# Altium project PCB_Project.PrjPcb
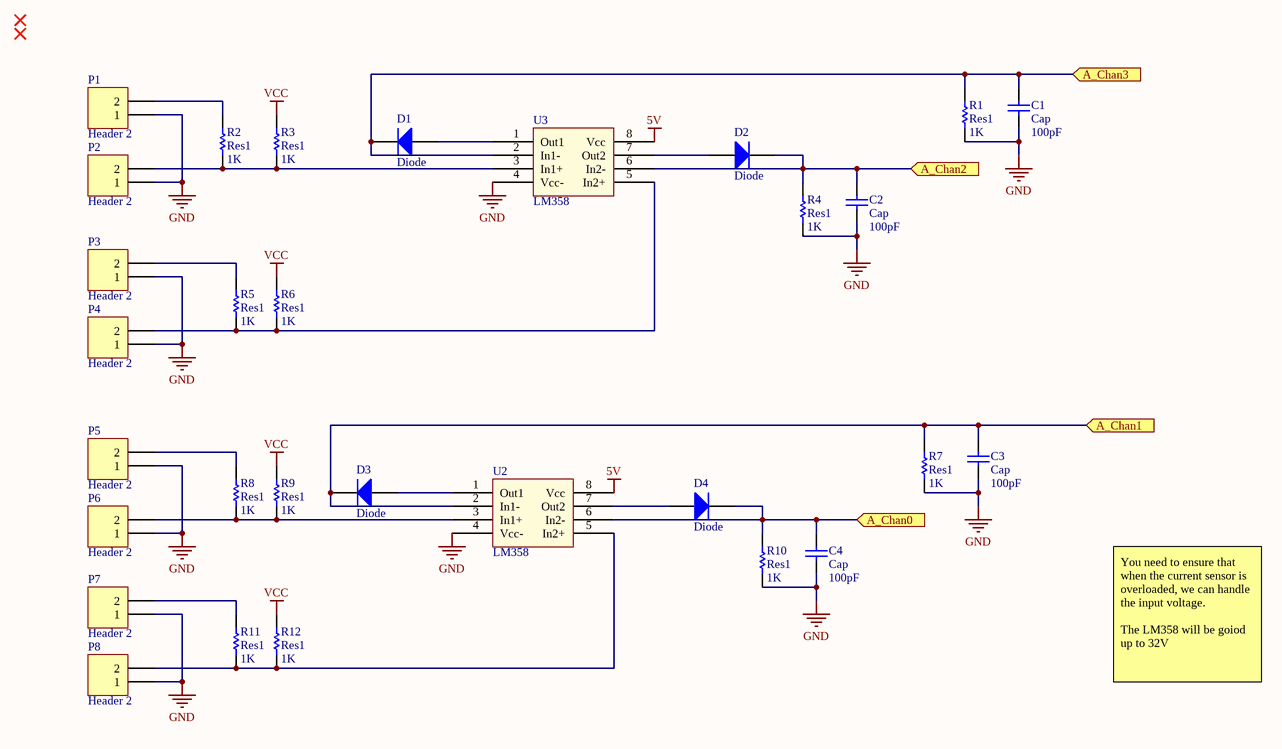
[diagram p0: AnalogIn.SchDoc]
3 sheets, 110 parts. Net scope: flat (ports and power ports of the same name join across sheets).
Board file: PCB1.PcbDoc
Sheets:
  AnalogIn.SchDoc
  Micro.SchDoc
  RTC-Power-Eth.SchDoc

## Sheet AnalogIn.SchDoc
size A4; SheetNumber: 1; SheetTotal: 3

### Parts
C1  Cap  value 100pF  [CAPC2012X04M]
C2  Cap  value 100pF  [CAPC2012X04M]
C3  Cap  value 100pF  [CAPC2012X04M]
C4  Cap  value 100pF  [CAPC2012X04M]
D1  Diode  [DIOC2012X04M]
D2  Diode  [DIOC2012X04M]
D3  Diode  [DIOC2012X04M]
D4  Diode  [DIOC2012X04M]
P1  Header 2  [HDR1X2]
P2  Header 2  [WURTH- WR-TBL 2pin 5mmpitch]
P3  Header 2  [HDR1X2]
P4  Header 2  [WURTH- WR-TBL 2pin 5mmpitch]
P5  Header 2  [HDR1X2]
P6  Header 2  [WURTH- WR-TBL 2pin 5mmpitch]
P7  Header 2  [HDR1X2]
P8  Header 2  [WURTH- WR-TBL 2pin 5mmpitch]
R1  Res1  value 1K  [RESC2012X04M]
R2  Res1  value 1K  [RESC2012X04M]
R3  Res1  value 1K  [RESC2012X04M]
R4  Res1  value 1K  [RESC2012X04M]
R5  Res1  value 1K  [RESC2012X04M]
R6  Res1  value 1K  [RESC2012X04M]
R7  Res1  value 1K  [RESC2012X04M]
R8  Res1  value 1K  [RESC2012X04M]
R9  Res1  value 1K  [RESC2012X04M]
R10  Res1  value 1K  [RESC2012X04M]
R11  Res1  value 1K  [RESC2012X04M]
R12  Res1  value 1K  [RESC2012X04M]
U2  LM358  [SOIC127P600X155-8N]
U3  LM358  [SOIC127P600X155-8N]

### Ports
A_Chan0 (in), A_Chan1 (in), A_Chan2 (in), A_Chan3 (in)

### Nets
5V: U2.8(Vcc) U3.8(Vcc)
GND: C1.1 C2.1 C3.1 C4.1 P1.1 P2.1 P3.1 P4.1 P5.1 P6.1 P7.1 P8.1 R1.1 R4.1 R7.1 R10.1 U2.4(Vcc-) U3.4(Vcc-)
VCC: R3.1 R6.1 R9.1 R12.1
NetC1_2: C1.2 D1.2(K) R1.2 U3.2(In1-) ; port A_Chan3
NetC2_2: C2.2 D2.2(K) R4.2 U3.6(In2-) ; port A_Chan2
NetC3_2: C3.2 D3.2(K) R7.2 U2.2(In1-) ; port A_Chan1
NetC4_2: C4.2 D4.2(K) R10.2 U2.6(In2-) ; port A_Chan0
NetD1_1: D1.1(A) U3.1(Out1)
NetD2_1: D2.1(A) U3.7(Out2)
NetD3_1: D3.1(A) U2.1(Out1)
NetD4_1: D4.1(A) U2.7(Out2)
NetP1_2: P1.2 R2.1
NetP2_2: P2.2 R2.2 R3.2 U3.3(In1+)
NetP3_2: P3.2 R5.1
NetP4_2: P4.2 R5.2 R6.2 U3.5(In2+)
NetP5_2: P5.2 R8.1
NetP6_2: P6.2 R8.2 R9.2 U2.3(In1+)
NetP7_2: P7.2 R11.1
NetP8_2: P8.2 R11.2 R12.2 U2.5(In2+)

### Notes on the sheet
- You need to ensure that when the current sensor is overloaded, we can handle the input voltage.
  The LM358 will be goiod up to 32V

### Library data of the parts
C1-C4 = Cap: Capacitor; Published: 8-Jun-2000; LatestRevisionDate: 17-Jul-2002; LatestRevisionNote: Re-released for DXP Platform.; PackageReference: RAD-0.3; Publisher: Altium Limited; PackageDescription: Radial Cap, Thru-Hole; 2 Leads; 0.3 in Pin Spacing
D1-D4 = Diode: Default Diode; Published: 8-Jun-2000; LatestRevisionDate: 17-Jul-2002; LatestRevisionNote: Re-released for DXP Platform.; PackageVersion: Sep-1996; PackageReference: SMC; Publisher: Altium Limited; PackageDescription: DO-214-AB/SMC; 2 C-Bend Leads; Body 7.9 x 5.9 mm, inc. leads (LxW); Code_JEDEC: DO-214-AB
P1-P8 = Header 2: Header, 2-Pin; LatestRevisionDate: 17-Jul-2002; LatestRevisionNote: Re-released for DXP Platform.; Publisher: Altium Limited
R1-R12 = Res1: Resistor; Published: 8-Jun-2000; LatestRevisionDate: 17-Jul-2002; LatestRevisionNote: Re-released for DXP Platform.; PackageReference: AXIAL-0.3; Publisher: Altium Limited; PackageDescription: Axial Device, Thru-Hole; 2 Leads; 0.3 in Pin Spacing

## Sheet Micro.SchDoc
size A4; SheetNumber: 2; SheetTotal: 3
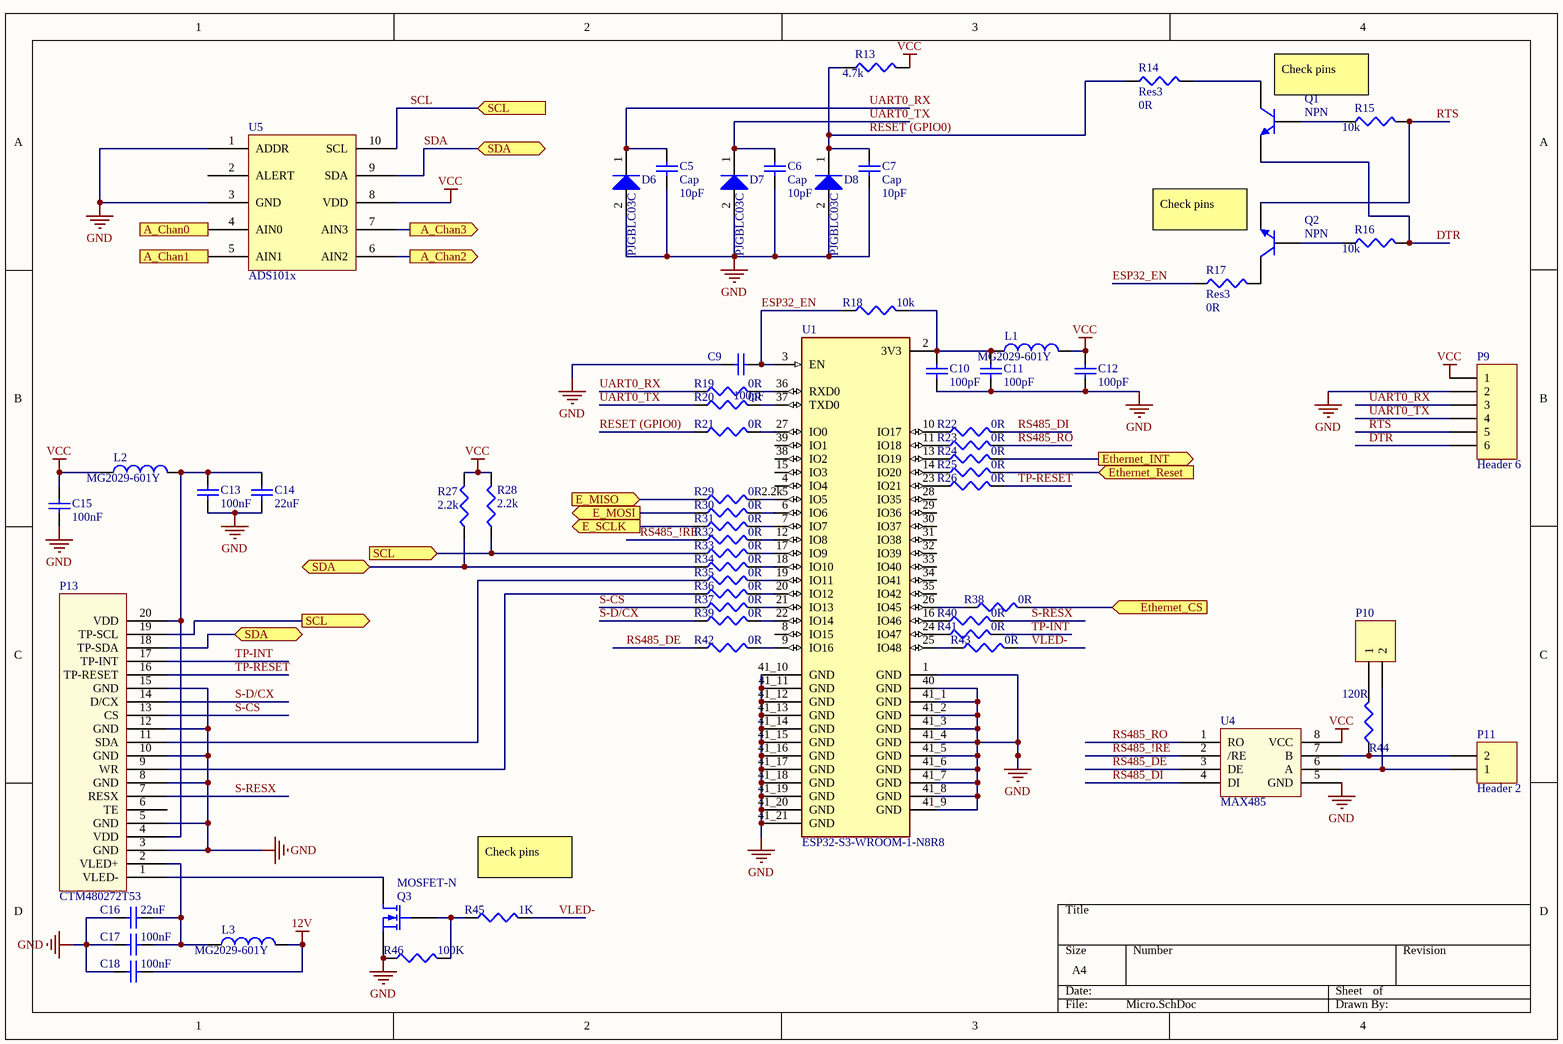
[diagram p1: Micro.SchDoc]

### Parts
C5  Cap  value 10pF  [CAPC2012X04M]
C6  Cap  value 10pF  [CAPC2012X04M]
C7  Cap  value 10pF  [CAPC2012X04M]
C9  value 100pF  [CAPC2012X04M]  (hidden comment: Cap)
C10  value 100pF  [CAPC2012X04M]  (hidden comment: Cap)
C11  value 100pF  [CAPC2012X04M]  (hidden comment: Cap)
C12  value 100pF  [CAPC2012X04M]  (hidden comment: Cap)
C13  value 100nF  [CAPC2012X04M]  (hidden comment: Cap)
C14  value 22uF  [CAPC2012X04M]  (hidden comment: Cap)
C15  value 100nF  [CAPC2012X04M]  (hidden comment: Cap)
C16  value 22uF  [CAPC2012X04M]  (hidden comment: Cap)
C17  value 100nF  [CAPC2012X04M]  (hidden comment: Cap)
C18  value 100nF  [CAPC2012X04M]  (hidden comment: Cap)
D6  PJGBLC03C  [DIOC2012X04M]
D7  PJGBLC03C  [DIOC2012X04M]
D8  PJGBLC03C  [DIOC2012X04M]
L1  value MG2029-601Y  [RESC2012X04M]  (hidden comment: Inductor)
L2  value MG2029-601Y  [RESC2012X04M]  (hidden comment: Inductor)
L3  value MG2029-601Y  [RESC2012X04M]  (hidden comment: Inductor)
P9  Header 6  [HDR1X6]
P10  Header 2  [HDR1X2]  (value not drawn)
P11  Header 2  [WURTH- WR-TBL 2pin 5mmpitch]
P13  CTM480272T53  [CF31201D0R0-05-NH]
Q1  NPN  [SOT95P245X110-3N]
Q2  NPN  [SOT95P245X110-3N]
Q3  MOSFET-N  [SOT95P245X110-3N]
R13  value 4.7k  [RESC2012X04M]  (hidden comment: Res3)
R14  Res3  value 0R  [RESC2012X04M]
R15  value 10k  [RESC2012X04M]  (hidden comment: Res3)
R16  value 10k  [RESC2012X04M]  (hidden comment: Res3)
R17  Res3  value 0R  [RESC2012X04M]
R18  value 10k  [RESC2012X04M]  (hidden comment: Res3)
R19  value 0R  [RESC2012X04M]  (hidden comment: Res3)
R20  value 0R  [RESC2012X04M]  (hidden comment: Res3)
R21  value 0R  [RESC2012X04M]  (hidden comment: Res3)
R22  value 0R  [RESC2012X04M]  (hidden comment: Res3)
R23  value 0R  [RESC2012X04M]  (hidden comment: Res3)
R24  value 0R  [RESC2012X04M]  (hidden comment: Res3)
R25  value 0R  [RESC2012X04M]  (hidden comment: Res3)
R26  value 0R  [RESC2012X04M]  (hidden comment: Res3)
R27  value 2.2k  [RESC2012X04M]  (hidden comment: Res3)
R28  value 2.2k  [RESC2012X04M]  (hidden comment: Res3)
R29  value 0R  [RESC2012X04M]  (hidden comment: Res3)
R30  value 0R  [RESC2012X04M]  (hidden comment: Res3)
R31  value 0R  [RESC2012X04M]  (hidden comment: Res3)
R32  value 0R  [RESC2012X04M]  (hidden comment: Res3)
R33  value 0R  [RESC2012X04M]  (hidden comment: Res3)
R34  value 0R  [RESC2012X04M]  (hidden comment: Res3)
R35  value 0R  [RESC2012X04M]  (hidden comment: Res3)
R36  value 0R  [RESC2012X04M]  (hidden comment: Res3)
R37  value 0R  [RESC2012X04M]  (hidden comment: Res3)
R38  value 0R  [RESC2012X04M]  (hidden comment: Res3)
R39  value 0R  [RESC2012X04M]  (hidden comment: Res3)
R40  value 0R  [RESC2012X04M]  (hidden comment: Res3)
R41  value 0R  [RESC2012X04M]  (hidden comment: Res3)
R42  value 0R  [RESC2012X04M]  (hidden comment: Res3)
R43  value 0R  [RESC2012X04M]  (hidden comment: Res3)
R44  value 120R  [RESC2012X04M]  (hidden comment: Res3)
R45  value 1K  [RESC2012X04M]  (hidden comment: Res3)
R46  value 100K  [RESC2012X04M]  (hidden comment: Res3)
U1  ESP32-S3-WROOM-1-N8R8  [XCVR_ESP32S3WROOM1N8R8]
U4  MAX485  [SOIC127P600X155-8N]
U5  ADS101x  [VSSOP_10]

### Ports
A_Chan0 (out), A_Chan1 (out), A_Chan2 (out), A_Chan3 (out), E_MISO (in), E_MOSI (out), E_SCLK (out), Ethernet_CS (in), Ethernet_INT (out), Ethernet_Reset (in), SCL (in), SCL (out), SDA (bidir)

### Nets
12V: C18.1 L3.2
GND: C5.1 C6.1 C7.1 C9.2 C10.2 C11.2 C12.2 C13.2 C14.2 C15.2 C16.2 C17.2 C18.2 D6.2(A) D7.2(A) D8.2(A) P9.2 P13.3(GND) P13.5(GND) P13.8(GND) P13.10(GND) P13.12(GND) P13.15(GND) Q3.3(S) R46.1 U1.1(GND) U1.40(GND) U1.41_1(GND) U1.41_2(GND) U1.41_3(GND) U1.41_4(GND) U1.41_5(GND) U1.41_6(GND) U1.41_7(GND) U1.41_8(GND) U1.41_9(GND) U1.41_10(GND) U1.41_11(GND) U1.41_12(GND) U1.41_13(GND) U1.41_14(GND) U1.41_15(GND) U1.41_16(GND) U1.41_17(GND) U1.41_18(GND) U1.41_19(GND) U1.41_20(GND) U1.41_21(GND) U4.5(GND) U5.1(ADDR) U5.3(GND)
VCC: C12.1 C15.1 L1.2 L2.1 P9.1 R13.2 R27.2 R28.2 U4.8(VCC) U5.8(VDD)
DTR: P9.6 Q1.3(E) R16.2
ESP32_EN: C9.1 R17.1 R18.1 U1.3(EN)
Eth_CS: R38.2 ; port Ethernet_CS
Eth_INT: R24.2 ; port Ethernet_INT
Eth_MISO: R29.1 ; port E_MISO
Eth_MOSI: R30.1 ; port E_MOSI
Eth_Reset: R25.2 ; port Ethernet_Reset
Eth_SCLK: R31.1 ; port E_SCLK
RESET (GPIO0): C7.2 D8.1(K) R13.1 R14.1 R21.1
RS485_!RE: R32.1 U4.2(/RE)
RS485_DE: R42.1 U4.3(DE)
RS485_DI: R22.2 U4.4(DI)
RS485_RO: R23.2 U4.1(RO)
RTS: P9.5 Q2.3(E) R15.2
S-CS: P13.13(CS) R37.1
S-D/CX: P13.14(D/CX) R39.1
S-RESX: P13.7(RESX) R40.2
SCL: P13.19(TP-SCL) R28.1 R33.1 U5.10(SCL) ; port SCL
SDA: P13.18(TP-SDA) R27.1 R34.1 U5.9(SDA) ; port SDA
TP-INT: P13.17(TP-INT) R41.2
TP-RESET: P13.16(TP-RESET) R26.2
UART0_RX: C5.2 D6.1(K) P9.3 R19.1
UART0_TX: C6.2 D7.1(K) P9.4 R20.1
VLED-: R43.2 R45.2
NetC1_2: U5.7(AIN3) ; port A_Chan3
NetC2_2: U5.6(AIN2) ; port A_Chan2
NetC3_2: U5.5(AIN1) ; port A_Chan1
NetC4_2: U5.4(AIN0) ; port A_Chan0
NetC10_1: C10.1 C11.1 L1.1 R18.2 U1.2(3V3)
NetC13_1: C13.1 C14.1 L2.2 P13.4(VDD) P13.20(VDD)
NetC16_1: C16.1 C17.1 L3.1 P13.2(VLED+)
NetP10_1: P10.1 R44.2
NetP10_2: P10.2 P11.1 U4.6(A)
NetP11_2: P11.2 R44.1 U4.7(B)
NetP13_1: P13.1(VLED-) Q3.1(D)
NetP13_9: P13.9(WR) R36.1
NetP13_11: P13.11(SDA) R35.1
NetQ1_1: Q1.1(C) R14.2
NetQ1_2: Q1.2(B) R15.1
NetQ2_1: Q2.1(C) R17.2
NetQ2_2: Q2.2(B) R16.1
NetQ3_2: Q3.2(G) R45.1 R46.2
NetR19_2: R19.2 U1.36(RXD0)
NetR20_2: R20.2 U1.37(TXD0)
NetR21_2: R21.2 U1.27(IO0)
NetR22_1: R22.1 U1.10(IO17)
NetR23_1: R23.1 U1.11(IO18)
NetR24_1: R24.1 U1.13(IO19)
NetR25_1: R25.1 U1.14(IO20)
NetR26_1: R26.1 U1.23(IO21)
NetR29_2: R29.2 U1.5(IO5)
NetR30_2: R30.2 U1.6(IO6)
NetR31_2: R31.2 U1.7(IO7)
NetR32_2: R32.2 U1.12(IO8)
NetR33_2: R33.2 U1.17(IO9)
NetR34_2: R34.2 U1.18(IO10)
NetR35_2: R35.2 U1.19(IO11)
NetR36_2: R36.2 U1.20(IO12)
NetR37_2: R37.2 U1.21(IO13)
NetR38_1: R38.1 U1.26(IO45)
NetR39_2: R39.2 U1.22(IO14)
NetR40_1: R40.1 U1.16(IO46)
NetR41_1: R41.1 U1.24(IO47)
NetR42_2: R42.2 U1.9(IO16)
NetR43_1: R43.1 U1.25(IO48)

Not connected (* = marked no-connect by the designer): P13 6(TE); U1 4(IO4) 8(IO15) 15(IO3) 28(IO35) 29(IO36) 30(IO37) 31(IO38) 32(IO39) 33(IO40) 34(IO41) 35(IO42) 38(IO2) 39(IO1); U5 2(ALERT)

### Notes on the sheet
- (near Q1) Check pins
- (near Q2) Check pins
- 2.2k
- (near R45) Check pins

### Library data of the parts
C5-C7 C9-C18 = Cap: Capacitor; Published: 8-Jun-2000; LatestRevisionDate: 17-Jul-2002; LatestRevisionNote: Re-released for DXP Platform.; PackageReference: RAD-0.3; Publisher: Altium Limited; PackageDescription: Radial Cap, Thru-Hole; 2 Leads; 0.3 in Pin Spacing
D6-D8 = SP4021-01FTG: Manufacturer: Littelfuse; PartNumber: SP4021-01FTG; PackageReference: SOD-323-2; Mounting Technology: Surface Mount
L1-L3 = Inductor: Code_IEC: 1005; Published: 8-Jun-2000; LatestRevisionDate: 29-May-2009; LatestRevisionNote: IPC-7351 Footprint Added.; PackageReference: 0402-A; Publisher: Altium Limited; PackageDescription: Chip Inductor; Code_JEITA: 0402
P9 = Header 6: Header, 6-Pin; LatestRevisionDate: 17-Jul-2002; LatestRevisionNote: Re-released for DXP Platform.; Publisher: Altium Limited
P10 P11 = Header 2: Header, 2-Pin; LatestRevisionDate: 17-Jul-2002; LatestRevisionNote: Re-released for DXP Platform.; Publisher: Altium Limited
P13 = CTM480272T53: pin to pad: 1>20 2>19 3>18 4>17 5>16 6>15 7>14 8>13 9>12 10>11 11>10 12>9 13>8 14>7 15>6 16>5 17>4 18>3 19>2 20>1
Q1 Q2 = NPN: NPN Bipolar Transistor; Published: 8-Jun-2000; LatestRevisionDate: 17-Jul-2002; LatestRevisionNote: Re-released for DXP Platform.; PackageReference: TO-226-AA; Publisher: Altium Limited; PackageDescription: TO, Flat Index; 3 In-Line, Axial Leads; Body Dia. 4.8mm; Leads 0.55 x 0.51 mm (max); Code_JEDEC: TO-226-AA
Q3 = MOSFET-N: N-Channel MOSFET; Published: 8-Jun-2000; LatestRevisionDate: 17-Jul-2002; LatestRevisionNote: Re-released for DXP Platform.; PackageVersion: 1995/1996; PackageReference: E3; Publisher: Altium Limited; PackageDescription: TO, Flat Index; 3 In-Line, Axial Leads; Body Dia. 4.6mm; Lead Dia. 0.5 mm (max)
R13-R46 = Res3: Resistor; Published: 8-Jun-2000; LatestRevisionDate: 29-May-2009; LatestRevisionNote: IPC-7351 Footprint Added.; PackageReference: J1-0603; Publisher: Altium Limited; PackageDescription: Chip Resistor
U1 = ESP32-S3-WROOM-1-N8R8: Bluetooth, WiFi 802.11b/g/n, Bluetooth v5.0 Transceiver Module 2.4GHz PCB Trace Surface Mount; MF: Espressif Systems; Package: None; Price: None; Check_prices: https://www.snapeda.com/parts/ESP32-S3-WROOM-1-N8R8/Espressif+Systems/view-part/?ref=eda; Value: *; SnapEDA_Link: https://www.snapeda.com/parts/ESP32-S3-WROOM-1-N8R8/Espressif+Systems/view-part/?ref=snap; MP: ESP32-S3-WROOM-1-N8R8; Availability: In Stock; Purchase-URL: https://pricing.snapeda.com/search?q=ESP32-S3-WROOM-1-N8R8&ref=eda

## Sheet RTC-Power-Eth.SchDoc
size A4; SheetNumber: 3; SheetTotal: 3
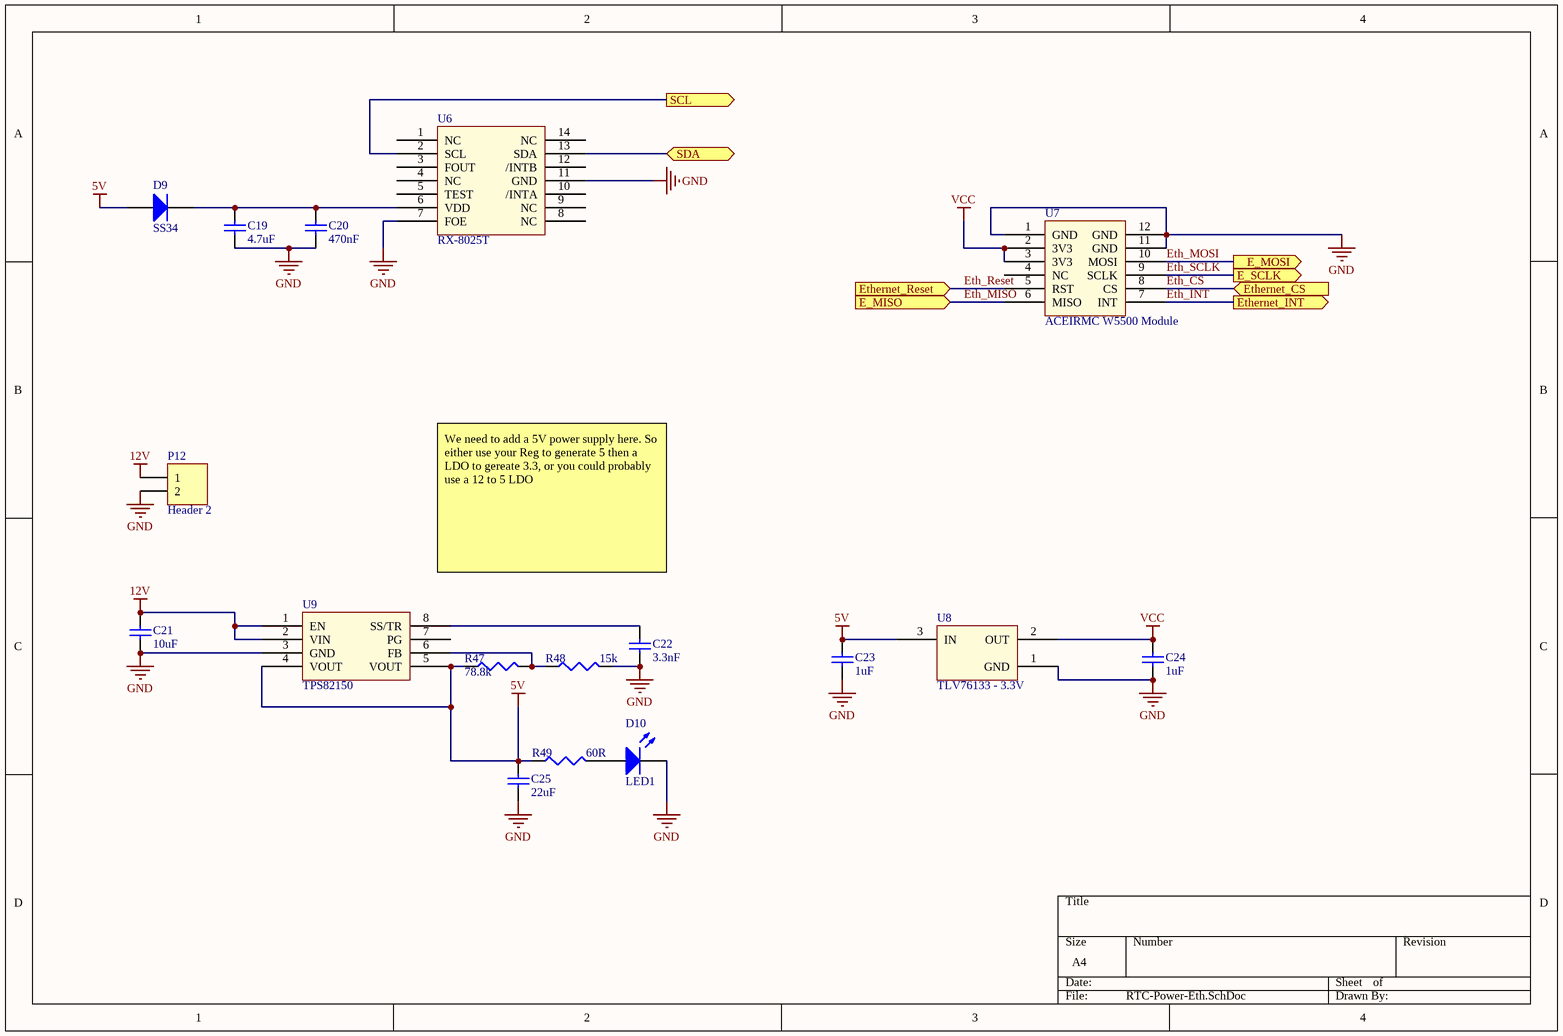
[diagram p2: RTC-Power-Eth.SchDoc]

### Parts
C19  value 4.7uF  [CAPC2012X04M]  (hidden comment: Cap)
C20  value 470nF  [CAPC2012X04M]  (hidden comment: Cap)
C21  value 10uF  [CAPC2012X04M]  (hidden comment: Cap)
C22  value 3.3nF  [CAPC2012X04M]  (hidden comment: Cap)
C23  value 1uF  [CAPC2012X04M]  (hidden comment: Cap)
C24  value 1uF  [CAPC2012X04M]  (hidden comment: Cap)
C25  value 22uF  [CAPC2012X04M]  (hidden comment: Cap)
D9  SS34  [DIOC2012X04M]
D10  LED1  [DIOC2012X04M]
P12  Header 2  [WURTH- WR-TBL 2pin 5mmpitch]
R47  value 78.8k  [RESC2012X04M]  (hidden comment: Res3)
R48  value 15k  [RESC2012X04M]  (hidden comment: Res3)
R49  value 60R  [RESC2012X04M]  (hidden comment: Res3)
U6  RX-8025T  [SOP127P740X320-14N]
U7  ACEIRMC W5500 Module  [W5500Module]
U8  TLV76133 - 3.3V  [SOT230P700X180-4N]
U9  TPS82150  [TPS82150SIL]

### Ports
E_MISO (in), E_MOSI (out), E_SCLK (out), Ethernet_CS (in), Ethernet_INT (out), Ethernet_Reset (in), SCL (out), SDA (bidir)

### Nets
5V: C23.1 C25.1 D9.1(A) R47.1 R49.1 U8.3(IN) U9.4(VOUT) U9.5(VOUT)
12V: C21.1 P12.1 U9.1(EN) U9.2(VIN)
GND: C19.2 C20.2 C21.2 C22.2 C23.2 C24.2 C25.2 D10.2(K) P12.2 R48.2 U6.7(FOE) U6.11(GND) U7.1(GND) U7.11(GND) U7.12(GND) U8.1(GND) U9.3(GND)
VCC: C24.1 U7.2(3V3) U7.3(3V3) U8.2(OUT)
Eth_CS: U7.8(CS) ; port Ethernet_CS
Eth_INT: U7.7(INT) ; port Ethernet_INT
Eth_MISO: U7.6(MISO) ; port E_MISO
Eth_MOSI: U7.10(MOSI) ; port E_MOSI
Eth_Reset: U7.5(RST) ; port Ethernet_Reset
Eth_SCLK: U7.9(SCLK) ; port E_SCLK
SCL: U6.2(SCL) ; port SCL
SDA: U6.13(SDA) ; port SDA
NetC19_1: C19.1 C20.1 D9.2(K) U6.6(VDD)
NetC22_1: C22.1 U9.8(SS/TR)
NetD10_1: D10.1(A) R49.2
NetR47_2: R47.2 R48.1 U9.6(FB)

Not connected (* = marked no-connect by the designer): U6 1(NC) 3(FOUT) 4(NC) 5(TEST) 8(NC) 9(NC) 10(/INTA) 12(/INTB) 14(NC); U7 4(NC); U9 7(PG)

### Notes on the sheet
- We need to add a 5V power supply here. So either use your Reg to generate 5 then a LDO to gereate 3.3, or you could probably use a 12 to 5 LDO

### Library data of the parts
C19-C25 = Cap: Capacitor; Published: 8-Jun-2000; LatestRevisionDate: 17-Jul-2002; LatestRevisionNote: Re-released for DXP Platform.; PackageReference: RAD-0.3; Publisher: Altium Limited; PackageDescription: Radial Cap, Thru-Hole; 2 Leads; 0.3 in Pin Spacing
D9 = Diode: Default Diode; Published: 8-Jun-2000; LatestRevisionDate: 17-Jul-2002; LatestRevisionNote: Re-released for DXP Platform.; PackageVersion: Sep-1996; PackageReference: SMC; Publisher: Altium Limited; PackageDescription: DO-214-AB/SMC; 2 C-Bend Leads; Body 7.9 x 5.9 mm, inc. leads (LxW); Code_JEDEC: DO-214-AB
D10 = LED1: Typical RED GaAs LED; Published: 8-Jun-2000; LatestRevisionDate: 08-Jul-2005; LatestRevisionNote: Mech Layer 1 removed.; PackageReference: LED-1; Publisher: Altium Limited; PackageDescription: LED; 2 Leads
P12 = Header 2: Header, 2-Pin; LatestRevisionDate: 17-Jul-2002; LatestRevisionNote: Re-released for DXP Platform.; Publisher: Altium Limited
R47-R49 = Res3: Resistor; Published: 8-Jun-2000; LatestRevisionDate: 29-May-2009; LatestRevisionNote: IPC-7351 Footprint Added.; PackageReference: J1-0603; Publisher: Altium Limited; PackageDescription: Chip Resistor
U8 = Generic LDO

## Nets that join several sheets
5V: AnalogIn (U2.8 U3.8), RTC-Power-Eth (8 pins)
12V: Micro (C18.1 L3.2), RTC-Power-Eth (C21.1 P12.1 U9.1 U9.2)
GND: AnalogIn (18 pins), Micro (51 pins), RTC-Power-Eth (17 pins)
VCC: AnalogIn (R3.1 R6.1 R9.1 R12.1), Micro (10 pins), RTC-Power-Eth (C24.1 U7.2 U7.3 U8.2)
Eth_CS: Micro (R38.2), RTC-Power-Eth (U7.8)
Eth_INT: Micro (R24.2), RTC-Power-Eth (U7.7)
Eth_MISO: Micro (R29.1), RTC-Power-Eth (U7.6)
Eth_MOSI: Micro (R30.1), RTC-Power-Eth (U7.10)
Eth_Reset: Micro (R25.2), RTC-Power-Eth (U7.5)
Eth_SCLK: Micro (R31.1), RTC-Power-Eth (U7.9)
NetC1_2: AnalogIn (C1.2 D1.2 R1.2 U3.2), Micro (U5.7)
NetC2_2: AnalogIn (C2.2 D2.2 R4.2 U3.6), Micro (U5.6)
NetC3_2: AnalogIn (C3.2 D3.2 R7.2 U2.2), Micro (U5.5)
NetC4_2: AnalogIn (C4.2 D4.2 R10.2 U2.6), Micro (U5.4)
SCL: Micro (P13.19 R28.1 R33.1 U5.10), RTC-Power-Eth (U6.2)
SDA: Micro (P13.18 R27.1 R34.1 U5.9), RTC-Power-Eth (U6.13)